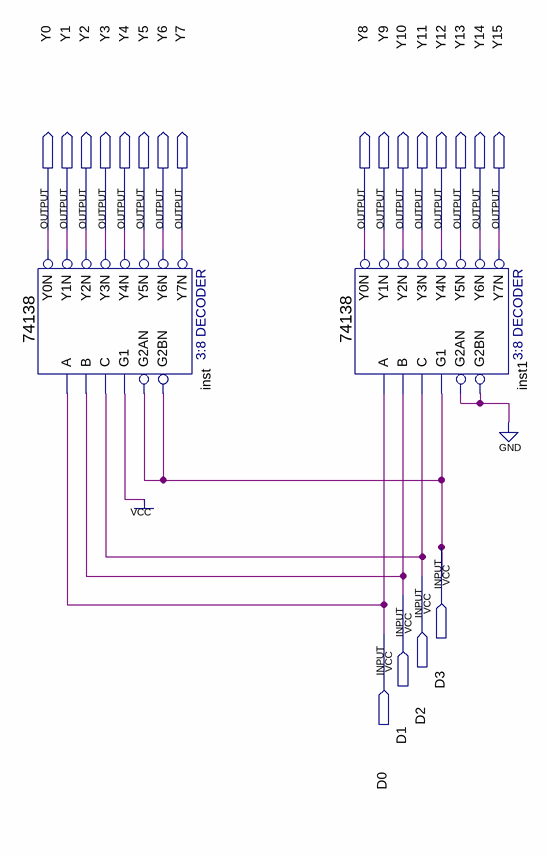
[diagram p0: schematic sheet]
// Quartus schematic 4-16.bdf as structural Verilog: 2 symbols, 20 pins
module \4-16  (
  input  D3,
  input  D2,
  input  D1,
  input  D0,
  output Y0,
  output Y1,
  output Y2,
  output Y3,
  output Y4,
  output Y5,
  output Y6,
  output Y7,
  output Y8,
  output Y9,
  output Y10,
  output Y11,
  output Y12,
  output Y13,
  output Y14,
  output Y15
);

  \74138  inst (
    .A(D0), .B(D1), .G1(1'b1), .C(D2), .G2AN(D3), .G2BN(D3), .Y0N(Y0), .Y1N(Y1), .Y2N(Y2), .Y3N(Y3),
    .Y4N(Y4), .Y5N(Y5), .Y6N(Y6), .Y7N(Y7));
  \74138  inst1 (
    .A(D0), .B(D1), .G1(D3), .C(D2), .G2AN(1'b0), .G2BN(1'b0), .Y0N(Y8), .Y1N(Y9), .Y2N(Y10), .Y3N(Y11),
    .Y4N(Y12), .Y5N(Y13), .Y6N(Y14), .Y7N(Y15));
endmodule
